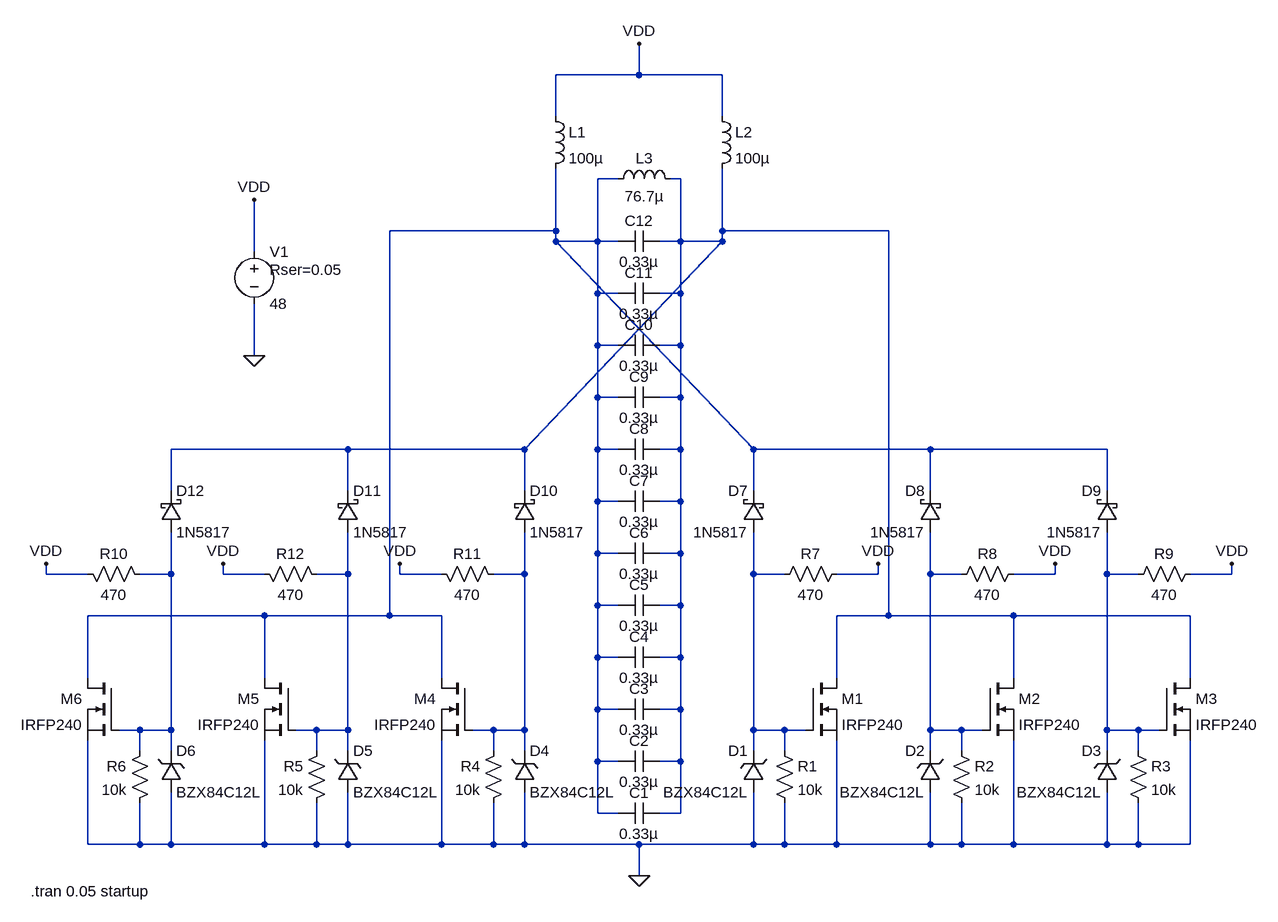
[diagram p0: schematic ZVS_circuit_kit.asc]
ZVS_circuit_kit.asc, the LTspice schematic file:
Version 4
SHEET 1 880 680
WIRE -96 -752 -96 -800
WIRE -96 -752 -224 -752
WIRE 32 -752 -96 -752
WIRE -224 -688 -224 -752
WIRE 32 -688 32 -752
WIRE -128 -592 -160 -592
WIRE -32 -592 -48 -592
WIRE -224 -512 -224 -608
WIRE -224 -512 -480 -512
WIRE 32 -512 32 -608
WIRE 288 -512 32 -512
WIRE -224 -496 -224 -512
WIRE -160 -496 -160 -592
WIRE -160 -496 -224 -496
WIRE -128 -496 -160 -496
WIRE -32 -496 -32 -592
WIRE -32 -496 -64 -496
WIRE 32 -496 32 -512
WIRE 32 -496 -32 -496
WIRE -688 -480 -688 -560
WIRE -160 -416 -160 -496
WIRE -128 -416 -160 -416
WIRE -32 -416 -32 -496
WIRE -32 -416 -64 -416
WIRE -160 -336 -160 -416
WIRE -128 -336 -160 -336
WIRE -32 -336 -32 -416
WIRE -32 -336 -64 -336
WIRE -688 -320 -688 -400
WIRE -160 -256 -160 -336
WIRE -128 -256 -160 -256
WIRE -32 -256 -32 -336
WIRE -32 -256 -64 -256
WIRE -544 -176 -816 -176
WIRE -272 -176 32 -496
WIRE -272 -176 -544 -176
WIRE -160 -176 -160 -256
WIRE -128 -176 -160 -176
WIRE -32 -176 -32 -256
WIRE -32 -176 -64 -176
WIRE 80 -176 -224 -496
WIRE 352 -176 80 -176
WIRE 624 -176 352 -176
WIRE -816 -112 -816 -176
WIRE -544 -112 -544 -176
WIRE -272 -112 -272 -176
WIRE 80 -112 80 -176
WIRE 352 -112 352 -176
WIRE 624 -112 624 -176
WIRE -160 -96 -160 -176
WIRE -128 -96 -160 -96
WIRE -32 -96 -32 -176
WIRE -32 -96 -64 -96
WIRE -160 -16 -160 -96
WIRE -128 -16 -160 -16
WIRE -32 -16 -32 -96
WIRE -32 -16 -64 -16
WIRE -1008 16 -1008 0
WIRE -944 16 -1008 16
WIRE -816 16 -816 -48
WIRE -816 16 -864 16
WIRE -736 16 -736 0
WIRE -672 16 -736 16
WIRE -544 16 -544 -48
WIRE -544 16 -592 16
WIRE -464 16 -464 0
WIRE -400 16 -464 16
WIRE -272 16 -272 -48
WIRE -272 16 -320 16
WIRE 80 16 80 -48
WIRE 128 16 80 16
WIRE 272 16 272 0
WIRE 272 16 208 16
WIRE 352 16 352 -48
WIRE 400 16 352 16
WIRE 544 16 544 0
WIRE 544 16 480 16
WIRE 624 16 624 -48
WIRE 672 16 624 16
WIRE 816 16 816 0
WIRE 816 16 752 16
WIRE -160 64 -160 -16
WIRE -128 64 -160 64
WIRE -32 64 -32 -16
WIRE -32 64 -64 64
WIRE -672 80 -944 80
WIRE -480 80 -480 -512
WIRE -480 80 -672 80
WIRE -400 80 -480 80
WIRE 288 80 288 -512
WIRE 288 80 208 80
WIRE 480 80 288 80
WIRE 752 80 480 80
WIRE -160 144 -160 64
WIRE -128 144 -160 144
WIRE -32 144 -32 64
WIRE -32 144 -64 144
WIRE -944 176 -944 80
WIRE -672 176 -672 80
WIRE -400 176 -400 80
WIRE 208 176 208 80
WIRE 480 176 480 80
WIRE 752 176 752 80
WIRE -160 224 -160 144
WIRE -128 224 -160 224
WIRE -32 224 -32 144
WIRE -32 224 -64 224
WIRE -864 256 -896 256
WIRE -816 256 -816 16
WIRE -816 256 -864 256
WIRE -592 256 -624 256
WIRE -544 256 -544 16
WIRE -544 256 -592 256
WIRE -320 256 -352 256
WIRE -272 256 -272 16
WIRE -272 256 -320 256
WIRE 80 256 80 16
WIRE 128 256 80 256
WIRE 160 256 128 256
WIRE 352 256 352 16
WIRE 400 256 352 256
WIRE 432 256 400 256
WIRE 624 256 624 16
WIRE 672 256 624 256
WIRE 704 256 672 256
WIRE -864 288 -864 256
WIRE -816 288 -816 256
WIRE -592 288 -592 256
WIRE -544 288 -544 256
WIRE -320 288 -320 256
WIRE -272 288 -272 256
WIRE 80 288 80 256
WIRE 128 288 128 256
WIRE 352 288 352 256
WIRE 400 288 400 256
WIRE 624 288 624 256
WIRE 672 288 672 256
WIRE -160 304 -160 224
WIRE -128 304 -160 304
WIRE -32 304 -32 224
WIRE -32 304 -64 304
WIRE -160 384 -160 304
WIRE -128 384 -160 384
WIRE -32 384 -32 304
WIRE -32 384 -64 384
WIRE -944 432 -944 272
WIRE -864 432 -864 368
WIRE -864 432 -944 432
WIRE -816 432 -816 352
WIRE -816 432 -864 432
WIRE -672 432 -672 272
WIRE -672 432 -816 432
WIRE -592 432 -592 368
WIRE -592 432 -672 432
WIRE -544 432 -544 352
WIRE -544 432 -592 432
WIRE -400 432 -400 272
WIRE -400 432 -544 432
WIRE -320 432 -320 368
WIRE -320 432 -400 432
WIRE -272 432 -272 352
WIRE -272 432 -320 432
WIRE -96 432 -272 432
WIRE 80 432 80 352
WIRE 80 432 -96 432
WIRE 128 432 128 368
WIRE 128 432 80 432
WIRE 208 432 208 272
WIRE 208 432 128 432
WIRE 352 432 352 352
WIRE 352 432 208 432
WIRE 400 432 400 368
WIRE 400 432 352 432
WIRE 480 432 480 272
WIRE 480 432 400 432
WIRE 624 432 624 352
WIRE 624 432 480 432
WIRE 672 432 672 368
WIRE 672 432 624 432
WIRE 752 432 752 272
WIRE 752 432 672 432
WIRE -96 480 -96 432
FLAG 272 0 VDD
FLAG 544 0 VDD
FLAG 816 0 VDD
FLAG -464 0 VDD
FLAG -736 0 VDD
FLAG -1008 0 VDD
FLAG -688 -560 VDD
FLAG -688 -320 0
FLAG -96 480 0
FLAG -96 -800 VDD
DATAFLAG -688 -528 ""
DATAFLAG -176 -752 ""
SYMBOL nmos 160 176 R0
SYMATTR InstName M1
SYMATTR Value IRFP240
SYMBOL zener 96 352 R180
WINDOW 0 24 64 Left 2
WINDOW 3 24 0 Left 2
SYMATTR InstName D1
SYMATTR Value BZX84C12L
SYMBOL res 112 272 R0
SYMATTR InstName R1
SYMATTR Value 10k
SYMBOL nmos 432 176 R0
SYMATTR InstName M2
SYMATTR Value IRFP240
SYMBOL zener 368 352 R180
WINDOW 0 24 64 Left 2
WINDOW 3 24 0 Left 2
SYMATTR InstName D2
SYMATTR Value BZX84C12L
SYMBOL res 384 272 R0
SYMATTR InstName R2
SYMATTR Value 10k
SYMBOL nmos 704 176 R0
SYMATTR InstName M3
SYMATTR Value IRFP240
SYMBOL zener 640 352 R180
WINDOW 0 24 64 Left 2
WINDOW 3 24 0 Left 2
SYMATTR InstName D3
SYMATTR Value BZX84C12L
SYMBOL res 656 272 R0
SYMATTR InstName R3
SYMATTR Value 10k
SYMBOL schottky 96 -48 R180
WINDOW 0 24 64 Left 2
WINDOW 3 24 0 Left 2
SYMATTR InstName D7
SYMATTR Value 1N5817
SYMATTR Description Diode
SYMATTR Type diode
SYMBOL schottky 368 -48 R180
WINDOW 0 24 64 Left 2
WINDOW 3 24 0 Left 2
SYMATTR InstName D8
SYMATTR Value 1N5817
SYMATTR Description Diode
SYMATTR Type diode
SYMBOL schottky 640 -48 R180
WINDOW 0 24 64 Left 2
WINDOW 3 24 0 Left 2
SYMATTR InstName D9
SYMATTR Value 1N5817
SYMATTR Description Diode
SYMATTR Type diode
SYMBOL res 768 0 R90
WINDOW 0 0 56 VBottom 2
WINDOW 3 32 56 VTop 2
SYMATTR InstName R9
SYMATTR Value 470
SYMBOL res 224 0 R90
WINDOW 0 0 56 VBottom 2
WINDOW 3 32 56 VTop 2
SYMATTR InstName R7
SYMATTR Value 470
SYMBOL res 496 0 R90
WINDOW 0 0 56 VBottom 2
WINDOW 3 32 56 VTop 2
SYMATTR InstName R8
SYMATTR Value 470
SYMBOL nmos -352 176 M0
SYMATTR InstName M4
SYMATTR Value IRFP240
SYMBOL zener -288 352 M180
WINDOW 0 24 64 Left 2
WINDOW 3 24 0 Left 2
SYMATTR InstName D4
SYMATTR Value BZX84C12L
SYMBOL res -304 272 M0
SYMATTR InstName R4
SYMATTR Value 10k
SYMBOL nmos -624 176 M0
SYMATTR InstName M5
SYMATTR Value IRFP240
SYMBOL zener -560 352 M180
WINDOW 0 24 64 Left 2
WINDOW 3 24 0 Left 2
SYMATTR InstName D5
SYMATTR Value BZX84C12L
SYMBOL res -576 272 M0
SYMATTR InstName R5
SYMATTR Value 10k
SYMBOL nmos -896 176 M0
SYMATTR InstName M6
SYMATTR Value IRFP240
SYMBOL zener -832 352 M180
WINDOW 0 24 64 Left 2
WINDOW 3 24 0 Left 2
SYMATTR InstName D6
SYMATTR Value BZX84C12L
SYMBOL res -848 272 M0
SYMATTR InstName R6
SYMATTR Value 10k
SYMBOL schottky -288 -48 M180
WINDOW 0 24 64 Left 2
WINDOW 3 24 0 Left 2
SYMATTR InstName D10
SYMATTR Value 1N5817
SYMATTR Description Diode
SYMATTR Type diode
SYMBOL schottky -560 -48 M180
WINDOW 0 24 64 Left 2
WINDOW 3 24 0 Left 2
SYMATTR InstName D11
SYMATTR Value 1N5817
SYMATTR Description Diode
SYMATTR Type diode
SYMBOL schottky -832 -48 M180
WINDOW 0 24 64 Left 2
WINDOW 3 24 0 Left 2
SYMATTR InstName D12
SYMATTR Value 1N5817
SYMATTR Description Diode
SYMATTR Type diode
SYMBOL res -960 0 M90
WINDOW 0 0 56 VBottom 2
WINDOW 3 32 56 VTop 2
SYMATTR InstName R10
SYMATTR Value 470
SYMBOL res -416 0 M90
WINDOW 0 0 56 VBottom 2
WINDOW 3 32 56 VTop 2
SYMATTR InstName R11
SYMATTR Value 470
SYMBOL res -688 0 M90
WINDOW 0 0 56 VBottom 2
WINDOW 3 32 56 VTop 2
SYMATTR InstName R12
SYMATTR Value 470
SYMBOL cap -64 368 R90
WINDOW 0 0 32 VBottom 2
WINDOW 3 32 32 VTop 2
SYMATTR InstName C1
SYMATTR Value 0.33µ
SYMBOL cap -64 288 R90
WINDOW 0 0 32 VBottom 2
WINDOW 3 32 32 VTop 2
SYMATTR InstName C2
SYMATTR Value 0.33µ
SYMBOL cap -64 208 R90
WINDOW 0 0 32 VBottom 2
WINDOW 3 32 32 VTop 2
SYMATTR InstName C3
SYMATTR Value 0.33µ
SYMBOL cap -64 128 R90
WINDOW 0 0 32 VBottom 2
WINDOW 3 32 32 VTop 2
SYMATTR InstName C4
SYMATTR Value 0.33µ
SYMBOL cap -64 48 R90
WINDOW 0 0 32 VBottom 2
WINDOW 3 32 32 VTop 2
SYMATTR InstName C5
SYMATTR Value 0.33µ
SYMBOL cap -64 -32 R90
WINDOW 0 0 32 VBottom 2
WINDOW 3 32 32 VTop 2
SYMATTR InstName C6
SYMATTR Value 0.33µ
SYMBOL cap -64 -112 R90
WINDOW 0 0 32 VBottom 2
WINDOW 3 32 32 VTop 2
SYMATTR InstName C7
SYMATTR Value 0.33µ
SYMBOL cap -64 -192 R90
WINDOW 0 0 32 VBottom 2
WINDOW 3 32 32 VTop 2
SYMATTR InstName C8
SYMATTR Value 0.33µ
SYMBOL cap -64 -272 R90
WINDOW 0 0 32 VBottom 2
WINDOW 3 32 32 VTop 2
SYMATTR InstName C9
SYMATTR Value 0.33µ
SYMBOL cap -64 -352 R90
WINDOW 0 0 32 VBottom 2
WINDOW 3 32 32 VTop 2
SYMATTR InstName C10
SYMATTR Value 0.33µ
SYMBOL cap -64 -432 R90
WINDOW 0 0 32 VBottom 2
WINDOW 3 32 32 VTop 2
SYMATTR InstName C11
SYMATTR Value 0.33µ
SYMBOL cap -64 -512 R90
WINDOW 0 0 32 VBottom 2
WINDOW 3 32 32 VTop 2
SYMATTR InstName C12
SYMATTR Value 0.33µ
SYMBOL ind -240 -704 R0
SYMATTR InstName L1
SYMATTR Value 100µ
SYMBOL ind 16 -704 R0
SYMATTR InstName L2
SYMATTR Value 100µ
SYMBOL ind -144 -576 R270
WINDOW 0 32 56 VTop 2
WINDOW 3 5 56 VBottom 2
SYMATTR InstName L3
SYMATTR Value 76.7µ
SYMBOL voltage -688 -496 R0
WINDOW 123 0 0 Left 0
WINDOW 39 24 44 Left 2
SYMATTR SpiceLine Rser=0.05
SYMATTR InstName V1
SYMATTR Value 48
TEXT -1032 504 Left 2 !.tran 0.05 startup

The netlist it stands for:
* ZVS_circuit_kit.asc
M1 N002 N006 0 0 IRFP240
D1 0 N006 BZX84C12L
R1 N006 0 10k
M2 N002 N007 0 0 IRFP240
D2 0 N007 BZX84C12L
R2 N007 0 10k
M3 N002 N008 0 0 IRFP240
D3 0 N008 BZX84C12L
R3 N008 0 10k
D7 N006 N001 1N5817
D8 N007 N001 1N5817
D9 N008 N001 1N5817
R9 VDD N008 470
R7 VDD N006 470
R8 VDD N007 470
M4 N001 N005 0 0 IRFP240
D4 0 N005 BZX84C12L
R4 N005 0 10k
M5 N001 N004 0 0 IRFP240
D5 0 N004 BZX84C12L
R5 N004 0 10k
M6 N001 N003 0 0 IRFP240
D6 0 N003 BZX84C12L
R6 N003 0 10k
D10 N005 N002 1N5817
D11 N004 N002 1N5817
D12 N003 N002 1N5817
R10 VDD N003 470
R11 VDD N005 470
R12 VDD N004 470
C1 N002 N001 0.33µ
C2 N002 N001 0.33µ
C3 N002 N001 0.33µ
C4 N002 N001 0.33µ
C5 N002 N001 0.33µ
C6 N002 N001 0.33µ
C7 N002 N001 0.33µ
C8 N002 N001 0.33µ
C9 N002 N001 0.33µ
C10 N002 N001 0.33µ
C11 N002 N001 0.33µ
C12 N002 N001 0.33µ
L1 VDD N001 100µ
L2 VDD N002 100µ
L3 N001 N002 76.7µ
V1 VDD 0 48 Rser=0.05
.model D D
.lib standard.dio
.model NMOS NMOS
.model PMOS PMOS
.lib standard.mos
.tran 0.05 startup
.backanno
.end